# EAGLE schematic electronic  cad schematic (EAGLE 7.6.0)
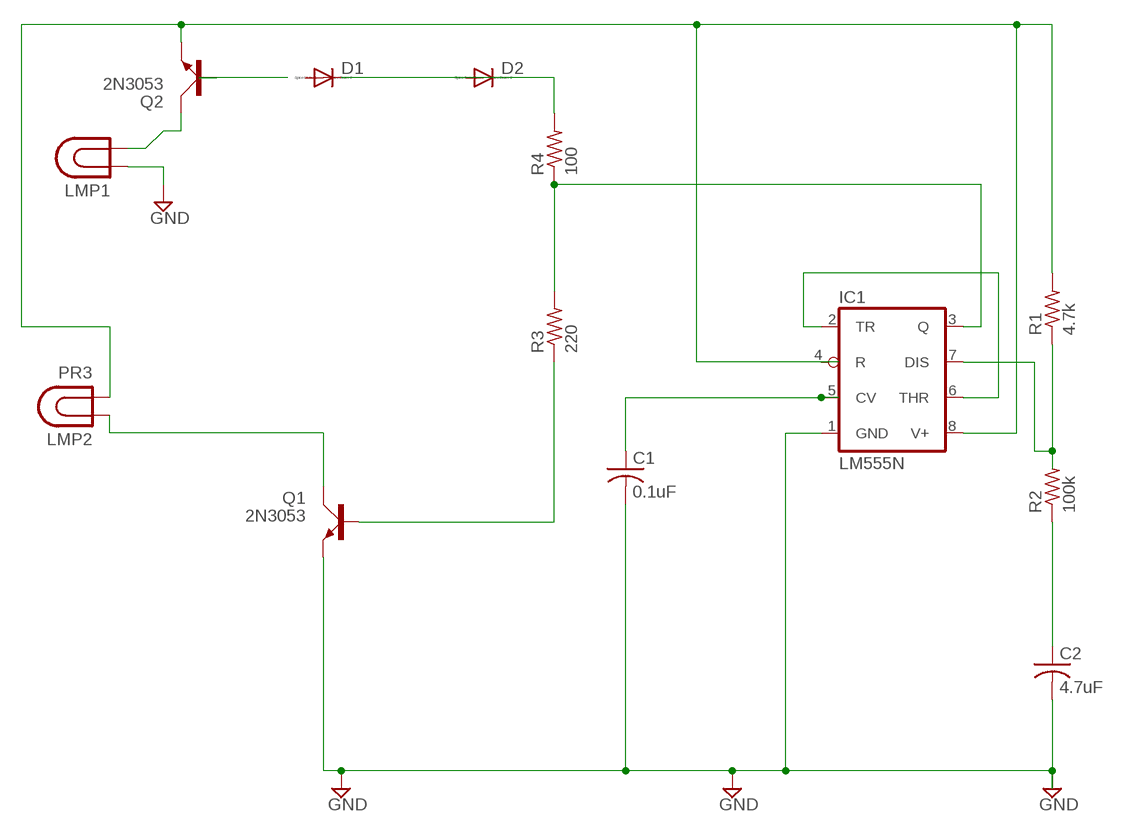
[diagram p0: schematic, sheet 1]

## Parts
C1  0.1uF  C-US050-025X075  [C050-025X075]
C2  4.7uF  C-US025_050-025X075  [C025_050-025X075]
D1  DIODE-D-2.5  [D-2.5]
D2  DIODE-D-2.5  [D-2.5]
IC1  LM555N  [DIL08]
LMP1  LAMP  [LDH-5R]
LMP2  PR3  LAMP  [LDH-5R]
Q1  2N3053  [TO39]
Q2  2N3053  [TO39]
R1  4.7k  R-US_0207/2V  [0207/2V]
R2  100k  R-US_0207/2V  [0207/2V]
R3  220  R-US_0207/2V  [0207/2V]
R4  100  R-US_0207/2V  [0207/2V]

## Nets
GND: C1.2 C2.2 IC1.1(GND) LMP1.1 Q1.1(E)
N$1: IC1.8(V+) LMP2.2 Q2.1(E) R1.2
N$2: C2.1 R2.1
N$3: IC1.7(DIS) R1.1
N$4: D1.C R4.2
N$6: LMP2.1 Q1.3(C)
N$7: IC1.2(TR) IC1.6(THR)
N$8: Q1.2(B) R3.1
N$10: LMP1.2 Q2.3(C)
N$11: C1.1 IC1.5(CV)
N$12: IC1.3(Q) R3.2 R4.1
Unconnected: D1.A D2.A D2.C IC1.4(R) Q2.2(B) R2.2

## Library data of the parts
C1 C2 = resistor:C-US: CAPACITOR, American symbol
D1 D2 = diode:DIODE-: DIODE
IC1 = linear:*555: TIMER
LMP1 LMP2 = special:LAMP: LED HOLDER
Q1 Q2 = transistor-small-signal:2N3053: NPN TRANSISTOR
R1-R4 = resistor:R-US_: RESISTOR, American symbol